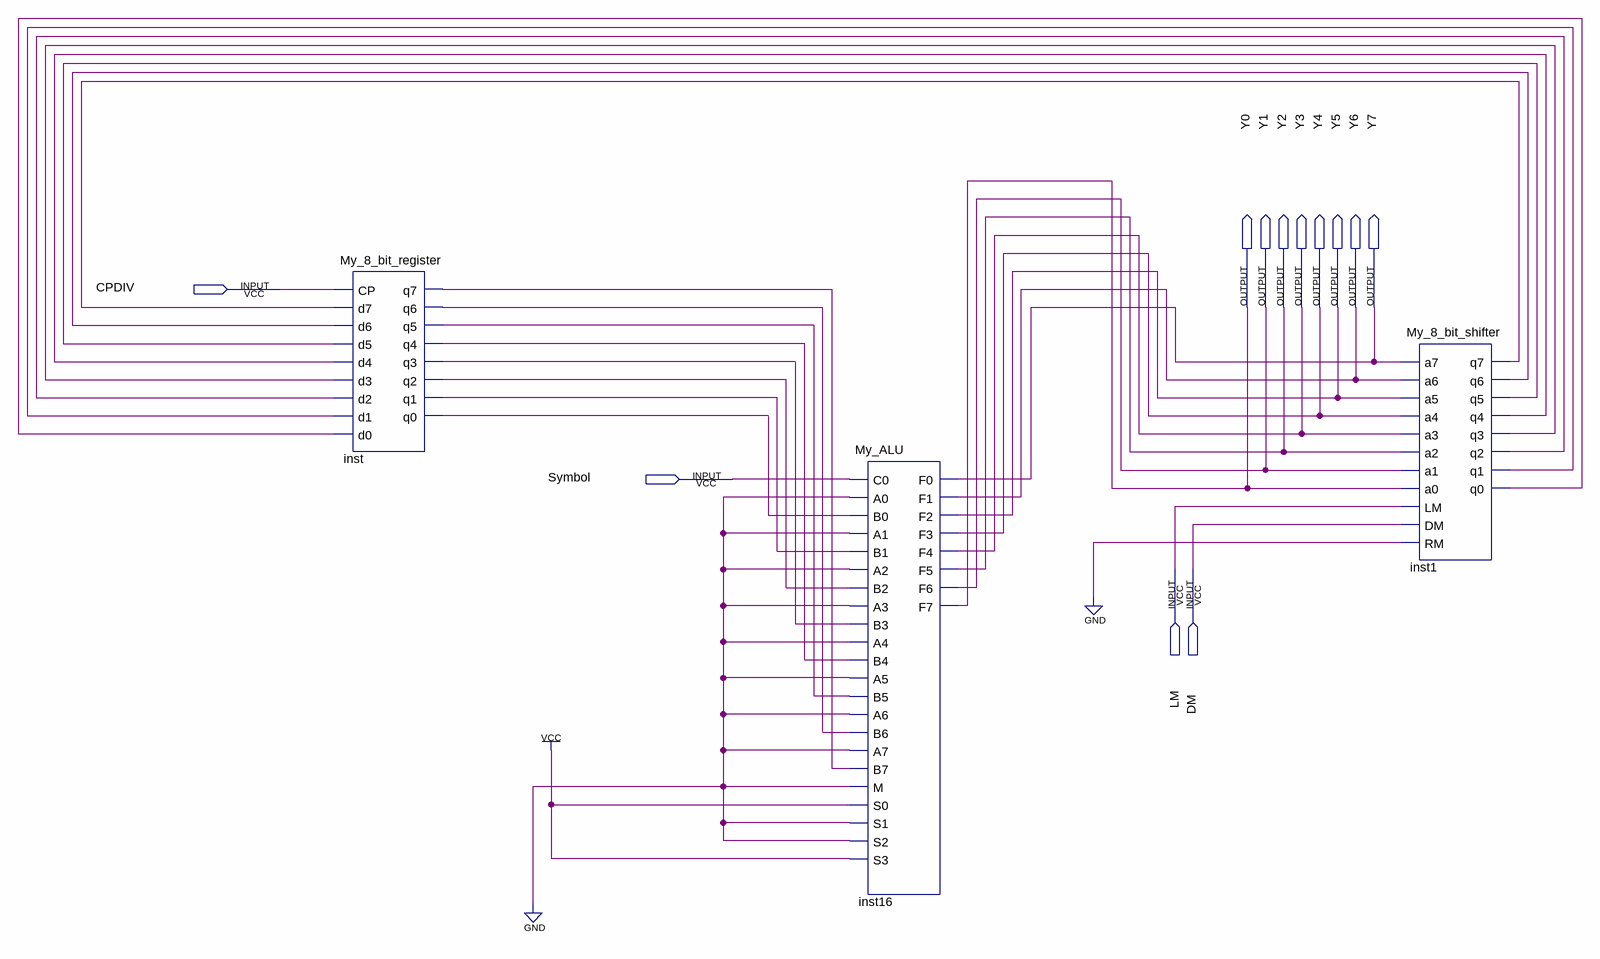
[diagram p0: schematic sheet]
// Quartus schematic My_Add_Sub_Alter.bdf as structural Verilog: 3 symbols, 12 pins
module My_Add_Sub_Alter (
  input  CPDIV,
  input  Symbol,
  input  LM,
  input  DM,
  output Y0,
  output Y1,
  output Y2,
  output Y3,
  output Y4,
  output Y5,
  output Y6,
  output Y7
);

  wire inst1_q0, inst1_q1, inst1_q2, inst1_q3, inst1_q4, inst1_q5, inst1_q6, inst1_q7, inst_q0, inst_q1,
       inst_q2, inst_q3, inst_q4, inst_q5, inst_q6, inst_q7;

  My_8_bit_register inst (
    .CP(CPDIV), .d7(inst1_q7), .d6(inst1_q6), .d5(inst1_q5), .d4(inst1_q4), .d3(inst1_q3), .d2(inst1_q2),
    .d1(inst1_q1), .d0(inst1_q0), .q7(inst_q7), .q6(inst_q6), .q5(inst_q5), .q4(inst_q4), .q3(inst_q3),
    .q2(inst_q2), .q1(inst_q1), .q0(inst_q0));
  My_ALU inst16 (
    .C0(Symbol), .A0(1'b0), .B0(inst_q0), .A1(1'b0), .B1(inst_q1), .A2(1'b0), .B2(inst_q2), .A3(1'b0),
    .B3(inst_q3), .A4(1'b0), .B4(inst_q4), .A5(1'b0), .B5(inst_q5), .A6(1'b0), .B6(inst_q6), .A7(1'b0),
    .B7(inst_q7), .M(1'b0), .S0(1'b1), .S1(1'b0), .S2(1'b0), .S3(1'b1), .F0(Y7), .F1(Y6), .F2(Y5), .F3(Y4),
    .F4(Y3), .F5(Y2), .F6(Y1), .F7(Y0));
  My_8_bit_shifter inst1 (
    .a7(Y7), .a6(Y6), .a5(Y5), .a4(Y4), .a3(Y3), .a2(Y2), .a1(Y1), .a0(Y0), .LM(LM), .DM(DM), .RM(1'b0),
    .q7(inst1_q7), .q6(inst1_q6), .q5(inst1_q5), .q4(inst1_q4), .q3(inst1_q3), .q2(inst1_q2), .q1(inst1_q1),
    .q0(inst1_q0));
endmodule
